# Altium project Indept_Study_OpAmp_Dev.PrjPcb
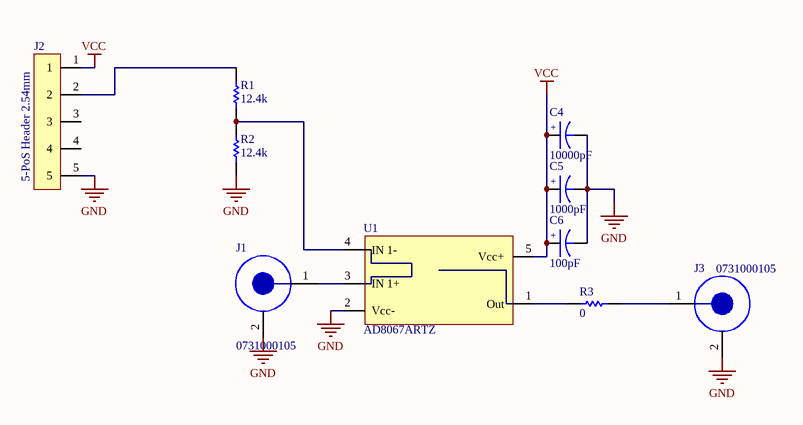
[diagram p0: OpAmpSCH.SchDoc]
1 sheet, 10 parts. Net scope: global (net labels, ports and power ports of the same name join across sheets).
Board file: OpAmpDevPCB.PcbDoc

## Sheet OpAmpSCH.SchDoc: SCH_Template
size B; Engineer: Benjamin Beaudoin; Revision: vX.X

### Parts
C4  10000pF  [0603C]
C5  1000pF  [0603C]
C6  100pF  [0603C]
J1  0731000105  [0731000105]
J2  5-PoS Header 2.54mm  [2.54mm Pitch Header]
J3  0731000105  [0731000105]
R1  12.4k  [0603C]
R2  12.4k  [0603C]
R3  0  [1206C]
U1  AD8067ARTZ  [MIC920]

### Nets
GND: C4.2 C5.2 C6.2 J1.2 J2.5 J3.2 R2.1 U1.2(Vcc-)
VCC: C4.1 C5.1 C6.1 J2.1 U1.5(Vcc+)
NetJ1_1: J1.1 U1.3(IN_1+)
NetJ2_2: J2.2 R1.2
NetJ3_1: J3.1 R3.2
NetR1_1: R1.1 R2.2 U1.4(IN_1-)
NetR3_1: R3.1 U1.1(Out)

Not connected (* = marked no-connect by the designer): J2 3 4

### Notes on the sheet
- (in symbol CPoly) +

### Library data of the parts
C4-C6 = CPoly: Cap Poly; Power_WV_SRF: 35V; MFG: *; MFGPN: *; Tolerance: *; Temp Coef: *; Distributor Reg Num: *; Distributor: *; CMPN: *
  C4: Value: 10000pF
  C5: Value: 1000pF
  C6: Value: 100pF
J1 J3 = 0731000105: BNC Connector Jack, Female Socket 50Ohm Through Hole, Right Angle Solder
R1-R3 = R: Resistor; Tolerance: 5%; Power_WV_SRF: *; MFG: *; MFGPN: *; Distributor: *; CMPN: *
  R1 R2: Value: 12.4k
  R3: Value: 0
U1 = AD8067ARTZ: IC OPAMP VFB 1